# EasyEDA schematic SCH_[已验证] 树莓派单锂直流UPS【低成本方案】_2024-01-14.json
TITLE: 理想二极管式UPS; REV: 1.0; Date: 20220125; Sheet: 1/1
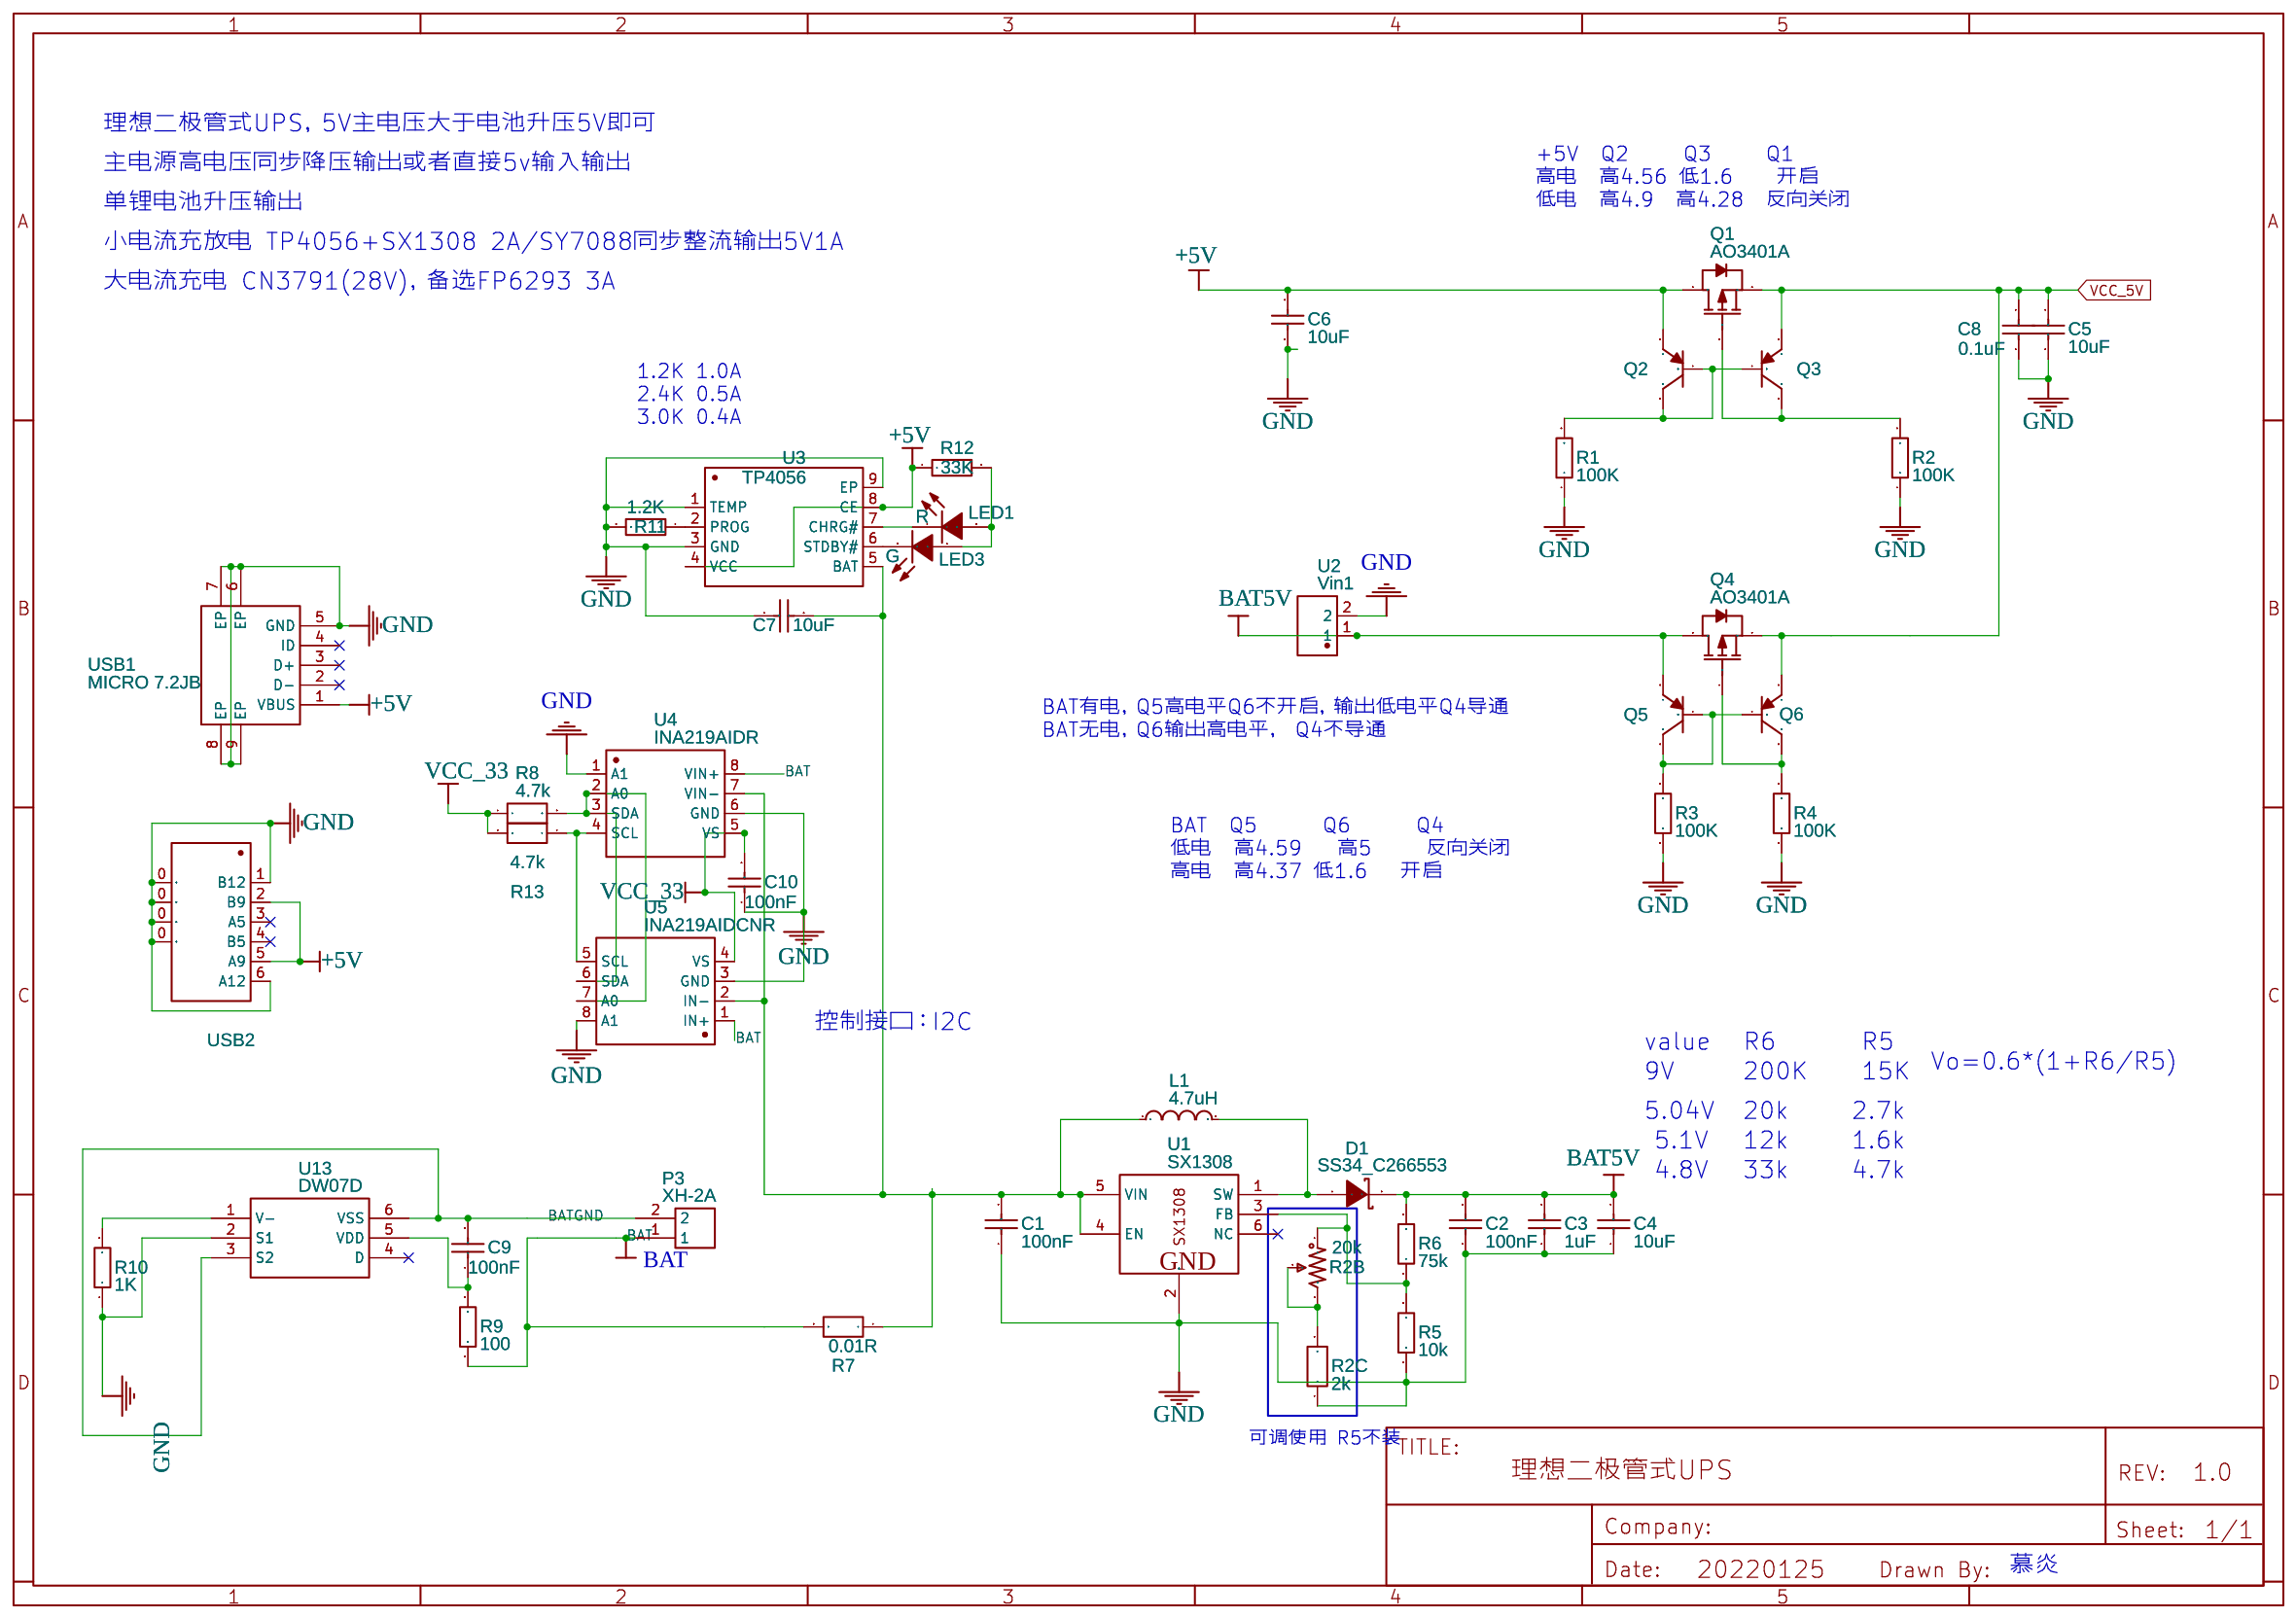
[diagram p0: schematic sheet]

## Parts
C1  100nF  [C0805]
C2  100nF  [C0805]
C3  1uF  [C0805]
C4  10uF  [C0805]
C5  10uF  [C0805]
C6  10uF  [C0805]
C7  10uF  [C0805]
C8  0.1uF  [C0805]
C9  100nF  [C0805]
C10  100nF  [C0805]
D1  SS34_C266553  [SMA(DO-214AC)]
L1  4.7uH  [IND-SMD_L7.1-W6.6]
LED1  R  [LED0805-RD_RED]
LED3  G  [LED0603-R-RD_GREEN]
P3  XH-2A  [XH-2A]
Q1  AO3401A  [SOT-23(SOT-23-3)]
Q2  BCW68GLT1G  [SOT-23(SOT-23-3)]
Q3  BCW68GLT1G  [SOT-23(SOT-23-3)]
Q4  AO3401A  [SOT-23(SOT-23-3)]
Q5  BCW68GLT1G  [SOT-23(SOT-23-3)]
Q6  BCW68GLT1G  [SOT-23(SOT-23-3)]
R1  100K  [R0805]
R2  100K  [R0805]
R2B  20k  [RES-ADJ-TH_3P-L10.0-W10.0-P2.50-L]
R2C  2k  [R0805]
R3  100K  [R0805]
R4  100K  [R0805]
R5  10k  [R0805]
R6  75k  [R0805]
R7  0.01R  [R2512]
R8  4.7k  [R0805]
R9  100  [R0805]
R10  1K  [R0805]
R11  1.2K  [R0603]
R12  33K  [R0603]
R13  4.7k  [R0805]
U1  SX1308  [SOT-23-6]
U2  Vin1  [CONN-TH_P5.08_KF127-5.08-2P]
U3  TP4056  [ESOP-8_L4.9-W3.9-P1.27-LS6.0-BL-EP]
U4  INA219AIDR  [SOIC-8_L4.9-W3.9-P1.27-LS6.0-BL]
U5  INA219AIDCNR  [SOT-23-8_L3.0-W1.7-P0.65-LS2.8-BR]
U13  DW07D  [SOT-23-6]
USB1  MICRO 7.2JB  [MICRO-USB-SMD_MICRO-7.2JB]
USB2  TYPE-C-31-M-17  [USB-C-SMD_10P-P1.00-L6.8-W8.9]

## Library data of the parts
C1 = CC0402KRX7R9BB104: Supplier: LCSC; Supplier Part: C131394; Manufacturer: YAGEO; Contributor: LCSC; Package Display: No
C2 = CC0402KRX7R9BB104: Supplier: LCSC; Supplier Part: C131394; Manufacturer: YAGEO; Contributor: LCSC
C3 = CL05A105KO5NNNC: Supplier: LCSC; Manufacturer: SAMSUNG; Supplier Part: C29266
C4-C6 C8 = CL10A106MO8NQNC: Supplier: LCSC; Manufacturer: SAMSUNG; Supplier Part: C92487
C7 = GRM21BB31C106KE15L: Supplier: LCSC; Supplier Part: C162317; Manufacturer: Murata Electronics; Contributor: LCSC
C9 C10 = CL05B104KO5NNNC: Supplier: LCSC; Manufacturer: SAMSUNG; LCSC Assembly: Yes; Supplier Part: C1525; SMT Type: Basic; Package Display: No
D1 = -: Supplier: LCSC; Supplier Part: C266553; Manufacturer: Bourne Semicon (Shenzhen); Manufacturer Part: SS34; Contributor: LCSC; LCSC Assembly: Yes; SMT Type: Extend
L1 = SLO0630H330MTT: Supplier: LCSC; Supplier Part: C207844; Manufacturer: Sunltech Tech; Contributor: LCSC; JLCPCB Part Class: Extended Part
LED1 = FC-2012HRK-620D: Supplier: LCSC; Manufacturer: NATIONSTAR; image: //image.lceda.cn/szlcsc/C84256.jpg; Supplier Part: C84256; LCSC Assembly: Yes; SMT Type: Basic; JLCPCB Part Class: Basic Part
LED3 = TJ-S2012SW8TGLC2G-A5: Supplier: LCSC; Supplier Part: C192319; Manufacturer: TOGIALED; Contributor: LCSC
P3 = -: Supplier: LCSC; Manufacturer: BOOMELE; image: //image.lceda.cn/szlcsc/C20079.jpg; Supplier Part: C20079
Q1 Q4 = -: Supplier: LCSC; Manufacturer: AOS; LCSC Assembly: Yes; image: //image.lceda.cn/szlcsc/C15127.jpg; Supplier Part: C15127; SMT Type: Basic
Q2 Q3 Q5 Q6 = -: Supplier: LCSC; Manufacturer: ON; Contributor: LCSC; Supplier Part: C165613; LCSC Assembly: Yes; SMT Type: Extend
R1-R4 = 0402WGF1003TCE: Supplier: LCSC; Manufacturer: UniOhm; LCSC Assembly: Yes; Supplier Part: C25741; SMT Type: Basic
R2B = 3296W-1-103: Supplier: LCSC; Supplier Part: C118954; Manufacturer: Chengdu Guosheng Tech; Contributor: LCSC; JLCPCB SMD: Yes; SMT Type: Extend
R2C = R_0603_EU: Contributor: LCEDA_Lib
R5 = 0402WGJ0102TCE: Supplier: LCSC; Manufacturer: UniOhm; Supplier Part: C25543; Package Display: No
R6 = RTT021402FTH: Supplier: LCSC; Manufacturer: RALEC; Supplier Part: C102806; Package Display: No
R7 R8 R13 = R_0805_EU: Contributor: LCEDA_Lib
R9 = AC0402JR-07100RL: Supplier: LCSC; Manufacturer: YAGEO; Supplier Part: C138288; Package Display: No
R10 = RMC04021K1%N: Supplier: LCSC; Supplier Part: C269675; Manufacturer: Tyohm; Contributor: LCSC; Package Display: No
R11 = RMC06031.2K1%N: Supplier: LCSC; Supplier Part: C325597; Manufacturer: Tyohm; Contributor: LCSC
R12 = RMC06031K1%N: Supplier: LCSC; Supplier Part: C269704; Manufacturer: Tyohm; Contributor: LCSC
U1 = -: sourceId: g4Yg9rJ1j; Supplier: LCSC; Manufacturer: SX; image: //image.lceda.cn/szlcsc/C78162.jpg; Supplier Part: C78162; LCSC Assembly: Yes; SMT Type: Extend
U2 = KF127-5.08-2P: Supplier: LCSC; Supplier Part: C474906; Manufacturer: Cixi Kefa Elec; Contributor: LCSC; JLCPCB SMD: Yes; SMT Type: Extend
U3 = TP4056_C382139: Supplier: LCSC; Supplier Part: C382139; Manufacturer: TPOWER; Contributor: LCSC; LCSC Assembly: Yes; SMT Type: Extend
U4 = INA219AIDR: Supplier: LCSC; Manufacturer: TI; Contributor: LCSC; Supplier Part: C138706; JLCPCB Part Class: Extended Part
U5 = INA219AIDCNR: Supplier: LCSC; Manufacturer: TI; Contributor: LCSC; Supplier Part: C87469; JLCPCB Part Class: Extended Part
U13 = -: Supplier: LCSC; Manufacturer: FM; Supplier Part: C89497; LCSC Assembly: Yes; SMT Type: Extend
USB1 = MICRO 7.2JB: Supplier: LCSC; Supplier Part: C2681559; Manufacturer: SHOU HAN(首韩); Contributor: LCSC; JLCPCB Part Class: Extended Part
USB2 = TYPE-C-31-M-17: Supplier: LCSC; Supplier Part: C283540; Manufacturer: Korean Hroparts Elec; Contributor: LCSC

## Nets
+5V: C6.2 Q1.3(D) Q2.2(E) R12.1 U3.4(VCC) U3.8(CE) USB1.1(VBUS) USB2.2(B9) USB2.5(A9)
GND: C1.1 C2.1 C3.1 C4.1 C5.1 C6.1 C7.1 C8.1 C10.1 R1.1 R2.1 R2C.1 R3.1 R4.1 R5.1 R10.1 R11.2 U1.2(GND) U2.2 U3.1(TEMP) U3.3(GND) U3.9(EP) U4.1(A1) U4.6(GND) U5.3(GND) U5.8(A1) U13.2(S1) USB1.5(GND) USB1.6(EP) USB1.7(EP) USB1.8(EP) USB1.9(EP) USB2.0 USB2.1(B12) USB2.6(A12)
VCC_5V: C5.2 C8.2 Q1.2(S) Q3.2(E) Q4.2(S) Q6.2(E)
VCC_33: C10.2 R8.1 R13.2 U4.5(VS) U5.4(VS)
BAT: P3.1 R7.2 R9.1 U4.8(VIN+) U5.1(IN+)
BAT5V: C2.2 C3.2 C4.2 D1.2(K) Q4.3(D) Q5.2(E) R6.2 U2.1
BATGND: C9.2 P3.2 U13.3(S2) U13.6(VSS)
Net-(C1-2): C1.2 C7.2 L1.1 R7.1 U1.4(EN) U1.5(VIN) U3.5(BAT) U4.7(VIN-) U5.2(IN-)
Net-(C9-1): C9.1 R9.2 U13.5(VDD)
Net-(D1-1): D1.1(A) L1.2 U1.1(SW)
Net-(LED1-1): LED1.1(-) U3.7(CHRG#)
Net-(LED1-2): LED1.2(+) LED3.1(A) R12.2
Net-(LED3-2): LED3.2(K) U3.6(STDBY#)
Net-(Q1-1): Q1.1(G) Q3.3(C) R2.2
Net-(Q2-1): Q2.1(B) Q2.3(C) Q3.1(B) R1.2
Net-(Q4-1): Q4.1(G) Q6.3(C) R4.2
Net-(Q5-1): Q5.1(B) Q5.3(C) Q6.1(B) R3.2
Net-(R2B-1): R2B.1 R5.2 R6.1 U1.3(FB)
Net-(R2B-2): R2B.2 R2B.3 R2C.2
Net-(R8-2): R8.2 U4.2(A0) U4.3(SDA) U5.6(SDA) U5.7(A0)
Net-(R10-2): R10.2 U13.1(V-)
Net-(R11-1): R11.1 U3.2(PROG)
Net-(R13-1): R13.1 U4.4(SCL) U5.5(SCL)

Not connected (* = marked no-connect by the designer): U1 6(NC)*; U13 4(D)*; USB1 2(D-)* 3(D+)* 4(ID)*; USB2 3(A5)* 4(B5)*

## Notes on the sheet
- 理想二极管式UPS，5V主电压大于电池升压5V即可
- 主电源高电压同步降压输出或者直接5v输入输出
- +5V  Q2     Q3     Q1
  高电  高4.56 低1.6    开启
  低电  高4.9  高4.28  反向关闭
- 单锂电池升压输出
- 小电流充放电 TP4056+SX1308 2A/SY7088同步整流输出5V1A
- 大电流充电 CN3791(28V)，备选FP6293 3A
- 1.2K 1.0A
  2.4K 0.5A
  3.0K 0.4A
- BAT有电，Q5高电平Q6不开启，输出低电平Q4导通
  BAT无电，Q6输出高电平， Q4不导通
- BAT  Q5      Q6      Q4
  低电  高4.59	高5     反向关闭
  高电  高4.37 低1.6   开启
- 控制接口：I2C
- value
- R6
- R5
- 9V
- 200K
- 15K
- Vo=0.6*(1+R6/R5)
- 5.04V
- 20k
- 2.7k
- 5.1V
- 12k
- 1.6k
- 4.8V
- 33k
- 4.7k
- 可调使用 R5不装
- 慕炎
